# Altium project Q24_ECU_V1.PrjPcb (part 2 of 3)

## Sheet DebuggerConnectors.SchDoc
size A4
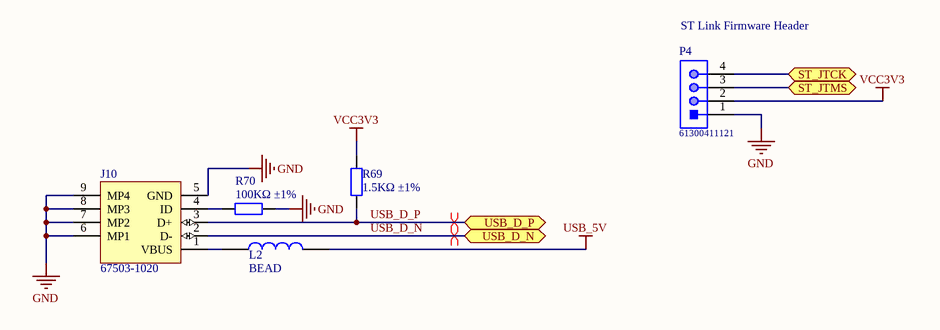
[diagram p7: DebuggerConnectors.SchDoc]

### Parts
J10  67503-1020  [MOLX-67503-1020_V]
L2  BEAD  [0603_L]
P4  61300411121  [61300411121]
R69  1.5KΩ ±1%  [0402_R]
R70  100KΩ ±1%  [0402_R]

### Ports
ST_JTCK (bidir), ST_JTMS (bidir), USB_D_N (bidir), USB_D_P (bidir)

### Nets
GND: J10.5(GND) J10.6(MP1) J10.7(MP2) J10.8(MP3) J10.9(MP4) P4.1 R70.2
USB_5V: L2.2
VCC3V3: P4.2 R69.2
ST_JTCK: P4.4 ; port ST_JTCK
ST_JTMS: P4.3 ; port ST_JTMS
USB_D_N: J10.2(D-) ; port USB_D_N
USB_D_P: J10.3(D+) R69.1 ; port USB_D_P
NetJ10_1: J10.1(VBUS) L2.1
NetJ10_4: J10.4(ID) R70.1

### Layout directives
differential pair: USB_D_N, USB_D_P

### Notes on the sheet
- (near P4) ST Link Firmware Header

### Library data of the parts
J10 = CMP-0411-00002-1: USB, MINI, SMD, RA KME04-USBMU03A01; Manufacturer: Molex; ComponentLink1URL: http://www.molex.com/; PartNumber: 67503-1020; Mounting Technology: Surface Mount; ComponentLink1Description: Manufacturer URL; Terminal Pitch: 0.8 mm; DatasheetVersion: Rev F, 06/2009; ComponentLink2Description: Datasheet; PackageDescription: Mini USB Connector, SMT, Righer Angle; ComponentLink2URL: http://www.molex.com/pdm_docs/sd/675031020_sd.pdf; PackageReference: 67503-1020
L2 = 0603 100R@100Mhz 1A: Ferrite Bead; Notepad: *; Package: 0603; Supplier: LC; SuppliersPartNumber: C64181
P4 = CMP-1502-01064-1: THT Vertical Pin Header WR-PHD, Pitch 2.54 mm, Single Row, 4 pins; Manufacturer: Wurth Elektronik; Withstanding Voltage: 500VAC; Rated Current: 3A; Working Voltage: 250VAC; Pin Number: 4; Gender: Male; Contact Resistance: 20mOhm; Pitch: 2.54mm; Manufacturer URL: http://www.we-online.de; Operating Temperature: -40to105degC; Packaging: Bag; Mounting Technology: THT; Package Reference: 61300411121; Datasheet URL: https://katalog.we-online.de/em/datasheet/6130xx11121.pdf; Publisher: WurthElektronik; Part Number: 61300411121; Row Number: Single; Orientation: Vertical
R69 = 0402 1.5K (1501) 1%: Chip resistor; Manufacturer: Uniroyal Elec; PartNumber: 0402WGF1501TCE; Power: 1/16W; ComponentLink1Description: Supplier link; ComponentLink1URL: http://www.szlcsc.com/product/details_26610.html; Package: 0402; Supplier: LC; SuppliersPartNumber: C25867; Resistance: 1.5KΩ; Tolerance: 1%
R70 = 0402 100K (1003) 1%: Chip resistor; Manufacturer: Uniroyal Elec; PartNumber: 0402WGF1003TCE; Power: 1/16W; ComponentLink1Description: Supplier link; ComponentLink1URL: http://www.szlcsc.com/product/details_26484.html; Package: 0402; Supplier: LC; SuppliersPartNumber: C25741; Resistance: 100KΩ; Tolerance: 1%

## Sheet 12V_POWER_BULKHEAD.SchDoc
size A4
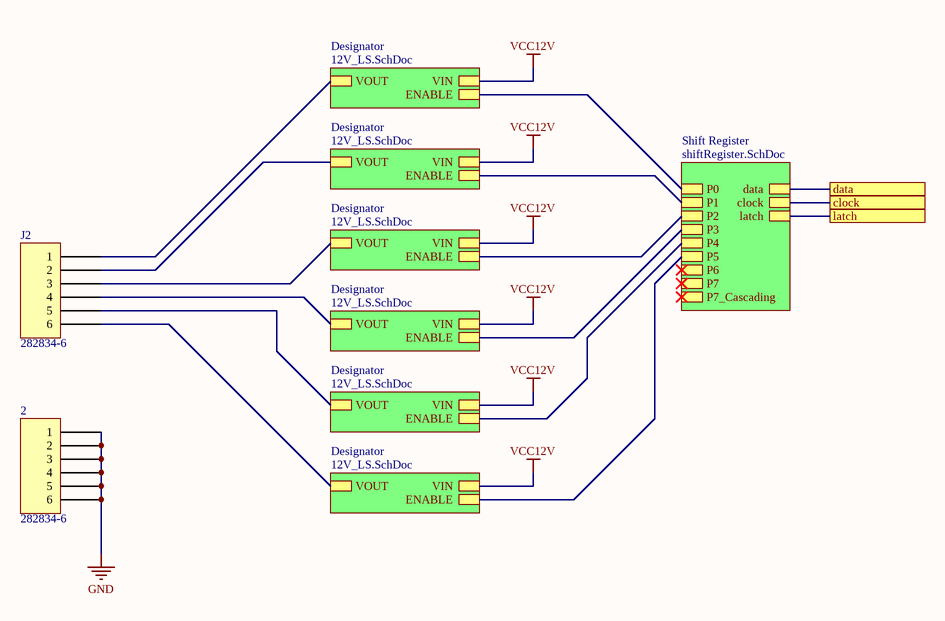
[diagram p8: 12V_POWER_BULKHEAD.SchDoc]

### Parts
2  282834-6  [TE 282834-6]
J2  282834-6  [TE 282834-6]

### Sub-sheets
Designator = 12V_LS.SchDoc: VOUT, ENABLE, VIN
Designator = 12V_LS.SchDoc: VOUT, ENABLE, VIN
Designator = 12V_LS.SchDoc: VOUT, ENABLE, VIN
Designator = 12V_LS.SchDoc: VOUT, ENABLE, VIN
Designator = 12V_LS.SchDoc: VOUT, ENABLE, VIN
Designator = 12V_LS.SchDoc: VOUT, ENABLE, VIN
Shift Register = shiftRegister.SchDoc: P0, P1, P2, P3, P4, P5, P6, P7, P7_Cascading, data, clock, latch

### Ports
clock, data, latch

### Nets
GND: 2.1 2.2 2.3 2.4 2.5 2.6
VCC12V: sheet Designator/VIN, sheet Designator/VIN, sheet Designator/VIN, sheet Designator/VIN, sheet Designator/VIN, sheet Designator/VIN
12V_CLOCK: port clock, sheet Shift Register/clock
12V_DATA: port data, sheet Shift Register/data
12V_LATCH: port latch, sheet Shift Register/latch
Net12_LOAD_SWITCH_12V_Power_And_Ground_Designator#1_2: sheet Shift Register/P0, sheet Designator/ENABLE
Net12_LOAD_SWITCH_12V_Power_And_Ground_Designator#1_7: J2.1 ; sheet Designator/VOUT
Net12_LOAD_SWITCH_12V_Power_And_Ground_Designator#2_2: sheet Shift Register/P1, sheet Designator/ENABLE
Net12_LOAD_SWITCH_12V_Power_And_Ground_Designator#2_7: J2.2 ; sheet Designator/VOUT
Net12_LOAD_SWITCH_12V_Power_And_Ground_Designator#3_2: sheet Shift Register/P2, sheet Designator/ENABLE
Net12_LOAD_SWITCH_12V_Power_And_Ground_Designator#3_7: J2.3 ; sheet Designator/VOUT
Net12_LOAD_SWITCH_12V_Power_And_Ground_Designator#4_2: sheet Shift Register/P3, sheet Designator/ENABLE
Net12_LOAD_SWITCH_12V_Power_And_Ground_Designator#4_7: J2.4 ; sheet Designator/VOUT
Net12_LOAD_SWITCH_12V_Power_And_Ground_Designator#5_2: sheet Shift Register/P4, sheet Designator/ENABLE
Net12_LOAD_SWITCH_12V_Power_And_Ground_Designator#5_7: J2.5 ; sheet Designator/VOUT
Net12_LOAD_SWITCH_12V_Power_And_Ground_Designator#6_2: sheet Shift Register/P5, sheet Designator/ENABLE
Net12_LOAD_SWITCH_12V_Power_And_Ground_Designator#6_7: J2.6 ; sheet Designator/VOUT

### Library data of the parts
2 J2 = 282834-6: TERM BLK 6P SIDE ENT 2.54MM PCB; Manufacturer: TE Connectivity AMP Connectors; Current: 10A; Mating Orientation: Horizontal with Board; Number of Levels: 1; Pitch: 0.100" (2.54mm); Positions Per Level: 6; Voltage: 150V; Wire Gauge: 16-30 AWG; Wire Termination: Screw - Rising Cage Clamp; Part Number: 282834-6; Color: Green; ComponentLink1Description: Datasheet; ComponentLink1URL: https://www.te.com/commerce/DocumentDelivery/DDEController?Action=srchrtrv&DocNm=282834&DocType=Customer+Drawing&DocLang=English; ComponentLink2Description: DigiKey Link; ComponentLink2URL: http://digikey.com/product-detail/en/te-connectivity-amp-connectors/282834-6/A98337-ND/1153267; LastUpdated: 2020-01-15 4:16:31 AM; Lifecycle Status: Active; Minimum Order: 1; Mounting Type: Through Hole; Packaging: Bulk; Part Status: Active; Price: 4.72; Series: Buchanan; Supplier 1: DigiKey; Supplier Part Number 1: A98337-ND

## Sheet shiftRegister.SchDoc
size A4
Used 2 times, as channels 12V Power And Ground/Shift Register, 5V Power And Ground/Shift Register. Parts and nets are listed once, with the designators drawn on the sheet.
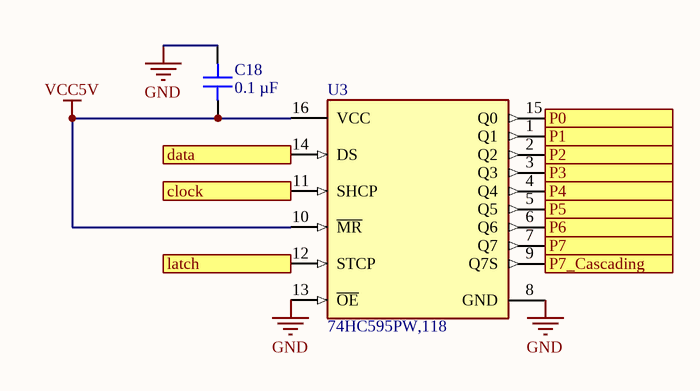
[diagram p9: shiftRegister.SchDoc]

### Parts
C18  0.1 µF  [CAP 0603_1608]
U3  74HC595PW,118  [FP-SOT403-1-MFG]

### Ports
clock, data, latch, P0, P1, P2, P3, P4, P5, P6, P7, P7_Cascading

### Nets
GND: C18.2 U3.8(GND) U3.13(~{OE})
VCC5V: C18.1 U3.10(~{MR}) U3.16(VCC)
clock: U3.11(SHCP) ; port clock
data: U3.14(DS) ; port data
latch: U3.12(STCP) ; port latch
P0: U3.15(Q0) ; port P0
P1: U3.1(Q1) ; port P1
P2: U3.2(Q2) ; port P2
P3: U3.3(Q3) ; port P3
P4: U3.4(Q4) ; port P4
P5: U3.5(Q5) ; port P5
P6: U3.6(Q6) ; port P6
P7: U3.7(Q7) ; port P7
P7_Cascading: U3.9(Q7S) ; port P7_Cascading

### Channels
12V Power And Ground/Shift Register: designators end in _Shift_Register2; ports clock=12V_CLOCK data=12V_DATA latch=12V_LATCH P0=Net12_LOAD_SWITCH_12V_Power_And_Ground_Designator#1_2 P1=Net12_LOAD_SWITCH_12V_Power_And_Ground_Designator#2_2 P2=Net12_LOAD_SWITCH_12V_Power_And_Ground_Designator#3_2 P3=Net12_LOAD_SWITCH_12V_Power_And_Ground_Designator#4_2 P4=Net12_LOAD_SWITCH_12V_Power_And_Ground_Designator#5_2 P5=Net12_LOAD_SWITCH_12V_Power_And_Ground_Designator#6_2 P6=NetU3_Shift_Register2_6 P7=NetU3_Shift_Register2_7 P7_Cascading=NetU3_Shift_Register2_9
5V Power And Ground/Shift Register: designators end in _Shift_Register1; ports clock=5V_CLOCK data=5V_DATA latch=5V_LATCH P0=NetIC1_5VLS1_3 P1=NetIC1_5VLS2_3 P2=NetIC1_5VLS3_3 P3=NetIC1_5VLS4_3 P4=NetIC1_5VLS5_3 P5=NetIC1_5VLS6_3 P6=NetU3_Shift_Register1_6 P7=NetU3_Shift_Register1_7 P7_Cascading=NetU3_Shift_Register1_9

### Library data of the parts
C18 = C0603C104K5RAC7411: CAP CER 0.1UF 50V X7R 0603; manufacturer: KEMET; Tolerance: ±10%; Part Number: C0603C104K5RAC7411; Value: 0.1 µF; Applications: Bypass, Decoupling; Capacitance: 0.1 µF; componentlink1description: Datasheet; componentlink1url: https://api.kemet.com/component-edge/download/datasheet/C0603C104K5RAC7411.pdf; componentlink2description: DigiKey Link; componentlink2url: https://www.digikey.com/en/products/detail/kemet/C0603C104K5RAC7411/3317013; Device Package: 0603 (1608 Metric); lastupdated: 2023-06-20 7:12:54 PM; Lifecycle Status: Active; Minimum Order: 1; Mounting Type: Surface Mount, MLCC; Operating Temperature: -55°C ~ 125°C; Package / Case: 0603 (1608 Metric); packaging: TapeAndReel; partid: 2233; Part Status: Active; price: 0.01; series: SMD Comm X7R; Size / Dimension: 0.063" L x 0.031" W (1.60mm x 0.80mm); Supplier 1: DigiKey; Supplier Part Number 1: 399-C0603C104K5RAC7411CT-ND; Temperature Coefficient: X7R; Thickness (Max): 0.035" (0.90mm); Voltage - Rated: 50V
U3 = CMP-14351-000004-1: IC SHIFT REGISTER 8BIT 16TSSOP

## Sheet 12V_LS.SchDoc
size A4
Used 9 times, as channels 12V Power And Ground/Designator, 12V Power And Ground/Designator, 12V Power And Ground/Designator, 12V Power And Ground/Designator, 12V Power And Ground/Designator, 12V Power And Ground/Designator, Motor Controller 1/Designator, Motor Controller 2/Designator, Steering/Designator. Parts and nets are listed once, with the designators drawn on the sheet.
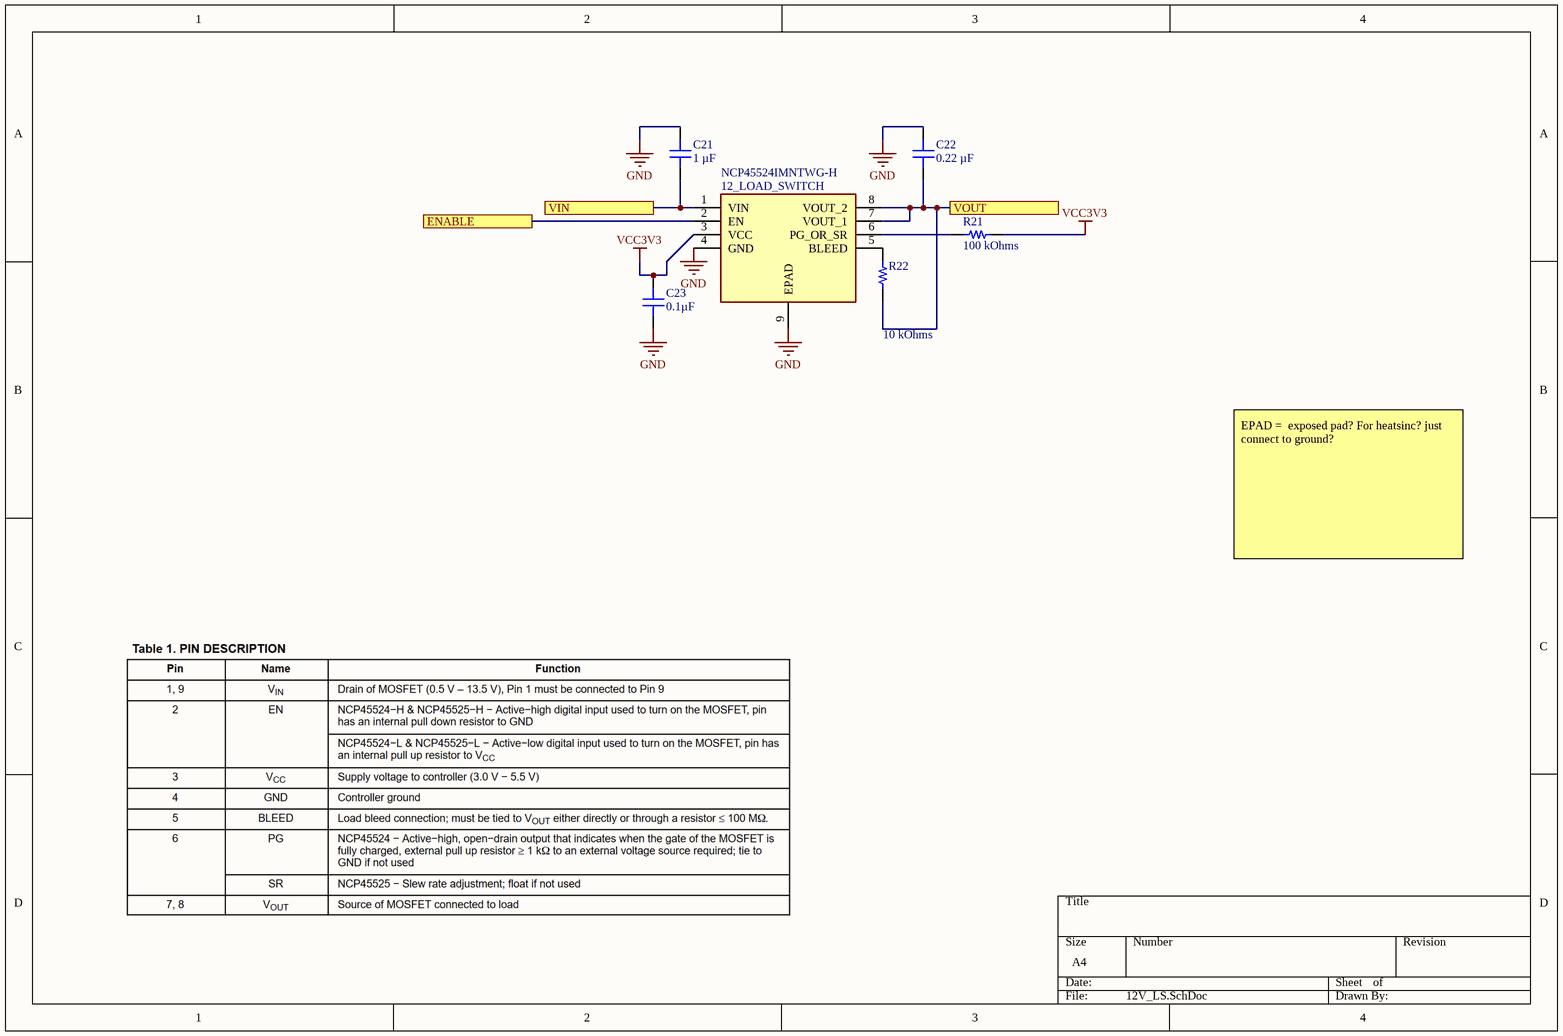
[diagram p10: 12V_LS.SchDoc]

### Parts
12_LOAD_SWITCH  NCP45524IMNTWG-H  [SON50P200X200X100-9N]
C21  1 µF  [CAP 0402_1005]
C22  0.22 µF  [CAP 0603_1608]
C23  0.1µF  [CAP 0402_1005]
R21  100 kOhms  [RES 0603_1608]
R22  10 kOhms  [RES 0603_1608]

### Ports
ENABLE, VIN, VOUT

### Nets
GND: 12_LOAD_SWITCH.4(GND) 12_LOAD_SWITCH.9(EPAD) C21.2 C22.2 C23.1
VCC3V3: 12_LOAD_SWITCH.3(VCC) C23.2 R21.2
ENABLE: 12_LOAD_SWITCH.2(EN) ; port ENABLE
VIN: 12_LOAD_SWITCH.1(VIN) C21.1 ; port VIN
VOUT: 12_LOAD_SWITCH.7(VOUT_1) 12_LOAD_SWITCH.8(VOUT_2) C22.1 R22.1 ; port VOUT
Net12_LOAD_SWITCH_5: 12_LOAD_SWITCH.5(BLEED) R22.2
Net12_LOAD_SWITCH_6: 12_LOAD_SWITCH.6(PG_OR_SR) R21.1

### Channels
12V Power And Ground/Designator: designators 12_LOAD_SWITCH=12_LOAD_SWITCH_12V_Power_And_Ground_Designator#1 C21=C21_12V_Power_And_Ground_Designator#1 C22=C22_Designator6 C23=C23_12V_Power_And_Ground_Designator#1 R21=R21_Designator6 R22=R22_Designator6; ports ENABLE=Net12_LOAD_SWITCH_12V_Power_And_Ground_Designator#1_2 VIN=VCC12V VOUT=Net12_LOAD_SWITCH_12V_Power_And_Ground_Designator#1_7
12V Power And Ground/Designator: designators 12_LOAD_SWITCH=12_LOAD_SWITCH_12V_Power_And_Ground_Designator#2 C21=C21_12V_Power_And_Ground_Designator#2 C22=C22_Designator5 C23=C23_12V_Power_And_Ground_Designator#2 R21=R21_Designator5 R22=R22_Designator5; ports ENABLE=Net12_LOAD_SWITCH_12V_Power_And_Ground_Designator#2_2 VIN=VCC12V VOUT=Net12_LOAD_SWITCH_12V_Power_And_Ground_Designator#2_7
12V Power And Ground/Designator: designators 12_LOAD_SWITCH=12_LOAD_SWITCH_12V_Power_And_Ground_Designator#3 C21=C21_12V_Power_And_Ground_Designator#3 C22=C22_Designator4 C23=C23_12V_Power_And_Ground_Designator#3 R21=R21_Designator4 R22=R22_Designator4; ports ENABLE=Net12_LOAD_SWITCH_12V_Power_And_Ground_Designator#3_2 VIN=VCC12V VOUT=Net12_LOAD_SWITCH_12V_Power_And_Ground_Designator#3_7
12V Power And Ground/Designator: designators 12_LOAD_SWITCH=12_LOAD_SWITCH_12V_Power_And_Ground_Designator#4 C21=C21_12V_Power_And_Ground_Designator#4 C22=C22_Designator3 C23=C23_12V_Power_And_Ground_Designator#4 R21=R21_Designator3 R22=R22_Designator3; ports ENABLE=Net12_LOAD_SWITCH_12V_Power_And_Ground_Designator#4_2 VIN=VCC12V VOUT=Net12_LOAD_SWITCH_12V_Power_And_Ground_Designator#4_7
12V Power And Ground/Designator: designators 12_LOAD_SWITCH=12_LOAD_SWITCH_12V_Power_And_Ground_Designator#5 C21=C21_12V_Power_And_Ground_Designator#5 C22=C22_Designator2 C23=C23_12V_Power_And_Ground_Designator#5 R21=R21_Designator2 R22=R22_Designator2; ports ENABLE=Net12_LOAD_SWITCH_12V_Power_And_Ground_Designator#5_2 VIN=VCC12V VOUT=Net12_LOAD_SWITCH_12V_Power_And_Ground_Designator#5_7
12V Power And Ground/Designator: designators 12_LOAD_SWITCH=12_LOAD_SWITCH_12V_Power_And_Ground_Designator#6 C21=C21_12V_Power_And_Ground_Designator#6 C22=C22_Designator1 C23=C23_12V_Power_And_Ground_Designator#6 R21=R21_Designator1 R22=R22_Designator1; ports ENABLE=Net12_LOAD_SWITCH_12V_Power_And_Ground_Designator#6_2 VIN=VCC12V VOUT=Net12_LOAD_SWITCH_12V_Power_And_Ground_Designator#6_7
Motor Controller 1/Designator: designators 12_LOAD_SWITCH=12_LOAD_SWITCH_Motor_Controller_1_Designator C21=C21_Motor_Controller_1_Designator C22=C22_Designator7 C23=C23_Motor_Controller_1_Designator R21=R21_Designator7 R22=R22_Designator7; ports ENABLE=MC1_ENABLE VIN=VCC12V VOUT=Net12_LOAD_SWITCH_Motor_Controller_1_Designator_7
Motor Controller 2/Designator: designators 12_LOAD_SWITCH=12_LOAD_SWITCH_Motor_Controller_2_Designator C21=C21_Motor_Controller_2_Designator C22=C22_Designator8 C23=C23_Motor_Controller_2_Designator R21=R21_Designator8 R22=R22_Designator8; ports ENABLE=MC2_ENABLE VIN=VCC12V VOUT=Net12_LOAD_SWITCH_Motor_Controller_2_Designator_7
Steering/Designator: designators 12_LOAD_SWITCH=12_LOAD_SWITCH_Steering_Designator C21=C21_Steering_Designator C22=C22_Designator9 C23=C23_Steering_Designator R21=R21_Designator9 R22=R22_Designator9; ports ENABLE=STEERING_ENABLE VIN=VCC12V VOUT=Net12_LOAD_SWITCH_Steering_Designator_7

### Notes on the sheet
- EPAD =  exposed pad? For heatsinc? just connect to ground?

### Library data of the parts
12_LOAD_SWITCH = NCP45524IMNTWG-H: Integrated Circuit; Manufacturer_Name: onsemi; Datasheet Link: http://www.onsemi.com/pub/Collateral/NCP45524-D.PDF; Height: 1mm; Manufacturer_Part_Number: NCP45524IMNTWG-H; Mouser Part Number: 863-NCP45524IMNTWG-H; Mouser Price/Stock: https://www.mouser.co.uk/ProductDetail/onsemi/NCP45524IMNTWG-H?qs=xGcJQ%252BnsJwsBahshTeqn2Q%3D%3D; Arrow Part Number: NCP45524IMNTWG-H; Arrow Price/Stock: https://www.arrow.com/en/products/ncp45524imntwg-h/on-semiconductor
C21 = GRM155C71A105KE11D: CAP CER 1UF 10V X7S 0402; manufacturer: Murata Electronics; Tolerance: ±10%; Part Number: GRM155C71A105KE11D; Value: 1 µF; Applications: General Purpose; Capacitance: 1 µF; componentlink1description: Datasheet; componentlink1url: https://search.murata.co.jp/Ceramy/image/img/A01X/G101/ENG/GRM155C71A105KE11-01.pdf; componentlink2description: DigiKey Link; componentlink2url: https://www.digikey.com/en/products/detail/murata-electronics/GRM155C71A105KE11D/6606086; Device Package: 0402 (1005 Metric); lastupdated: 2023-06-04 7:05:15 PM; Lifecycle Status: Active; Minimum Order: 1; Mounting Type: Surface Mount, MLCC; Operating Temperature: -55°C ~ 125°C; Package / Case: 0402 (1005 Metric); packaging: TapeAndReel; partid: 1749; Part Status: Active; price: 0.01; series: GRM; Size / Dimension: 0.039" L x 0.020" W (1.00mm x 0.50mm); Supplier 1: DigiKey; Supplier Part Number 1: 490-14457-1-ND; Temperature Coefficient: X7S; Thickness (Max): 0.024" (0.60mm); Voltage - Rated: 10V
C22 = CC0603KRX7R8BB224: CAP CER 0.22UF 25V X7R 0603; manufacturer: Yageo; Tolerance: ±10%; Part Number: CC0603KRX7R8BB224; Value: 0.22 µF; Applications: General Purpose; Capacitance: 0.22 µF; componentlink1description: Datasheet; componentlink1url: https://www.yageo.com/upload/media/product/productsearch/datasheet/mlcc/UPY-GPHC_X7R_6.3V-to-50V_18.pdf; componentlink2description: DigiKey Link; componentlink2url: https://www.digikey.com/en/products/detail/yageo/CC0603KRX7R8BB224/5195211; Device Package: 0603 (1608 Metric); lastupdated: 2023-06-21 7:13:30 PM; Lifecycle Status: Active; Minimum Order: 1; Mounting Type: Surface Mount, MLCC; Operating Temperature: -55°C ~ 125°C; Package / Case: 0603 (1608 Metric); packaging: TapeAndReel; partid: 2214; Part Status: Active; price: 0.01; series: CC; Size / Dimension: 0.063" L x 0.031" W (1.60mm x 0.80mm); Supplier 1: DigiKey; Supplier Part Number 1: 311-1803-1-ND; Temperature Coefficient: X7R; Thickness (Max): 0.035" (0.90mm); Voltage - Rated: 25V
C23 = 0402ZC104KAT2A: CAP CER 0.1UF 10V X7R 0402; manufacturer: AVX Corporation; Tolerance: ±10%; Part Number: 0402ZC104KAT2A; Value: 0.1µF; Applications: General Purpose; Capacitance: 0.1µF; componentlink1description: Datasheet; componentlink1url: http://datasheets.avx.com/X7RDielectric.pdf; componentlink2description: DigiKey Link; componentlink2url: http://digikey.com/product-detail/en/avx-corporation/0402ZC104KAT2A/478-7891-1-ND/3881514; Device Package: 0402 (1005 Metric); lastupdated: 2022-02-08 12:26:59 PM; Lifecycle Status: Active; Minimum Order: 1; Mounting Type: Surface Mount, MLCC; Operating Temperature: -55°C ~ 125°C; Package / Case: 0402 (1005 Metric); packaging: TapeAndReel; partid: 1757; Part Status: Active; price: 0.09; series: -; Size / Dimension: 0.039" L x 0.020" W (1.00mm x 0.50mm); Supplier 1: DigiKey; Supplier Part Number 1: 478-7891-1-ND; Temperature Coefficient: X7R; Thickness (Max): 0.022" (0.55mm); Voltage - Rated: 10V
R21 = RNCS0603BKE100K: RES 100K OHM 0.1% 1/16W 0603; Manufacturer: Stackpole Electronics Inc; Power (Watts): 0.063W, 1/16W; Temperature Coefficient: ±25ppm/°C; Part Number: RNCS0603BKE100K; Value: 100 kOhms; ComponentLink1Description: Datasheet; ComponentLink1URL: https://www.seielect.com/catalog/sei-rncs_rnch.pdf; ComponentLink2Description: DigiKey Link; ComponentLink2URL: https://www.digikey.com/en/products/detail/stackpole-electronics-inc/RNCS0603BKE100K/1708835; Composition: Thin Film; Device Package: 0603 (1608 Metric); Features: Anti-Corrosive, Automotive AEC-Q200, Moisture Resistant; Height - Seated (Max): 0.022" (0.55mm); LastUpdated: 2023-06-04 7:36:27 PM; Lifecycle Status: Active; Minimum Order: 1; Number of Terminations: 2; Operating Temperature: -55°C ~ 155°C; Package / Case: 0603 (1608 Metric); Packaging: TapeAndReel; PartId: 4849; Part Status: Active; Price: 0.07; Ratings: AEC-Q200; Resistance: 100 kOhms; Series: RNCS; Size / Dimension: 0.061" L x 0.031" W (1.55mm x 0.80mm); Supplier 1: DigiKey; Supplier Part Number 1: RNCS0603BKE100KCT-ND; Supplier Device Package: 0603; Tolerance: ±0.1%
R22 = RNCS0603BKE10K0: RES 10K OHM 0.1% 1/16W 0603; Manufacturer: Stackpole Electronics Inc; Power (Watts): 0.063W, 1/16W; Temperature Coefficient: ±25ppm/°C; Part Number: RNCS0603BKE10K0; Value: 10 kOhms; ComponentLink1Description: Datasheet; ComponentLink1URL: https://www.seielect.com/catalog/sei-rncs_rnch.pdf; ComponentLink2Description: DigiKey Link; ComponentLink2URL: https://www.digikey.com/en/products/detail/stackpole-electronics-inc/RNCS0603BKE10K0/1708836; Composition: Thin Film; Device Package: 0603 (1608 Metric); Features: Anti-Corrosive, Automotive AEC-Q200, Moisture Resistant; Height - Seated (Max): 0.022" (0.55mm); LastUpdated: 2023-06-04 7:36:27 PM; Lifecycle Status: Active; Minimum Order: 1; Number of Terminations: 2; Operating Temperature: -55°C ~ 155°C; Package / Case: 0603 (1608 Metric); Packaging: TapeAndReel; PartId: 4838; Part Status: Active; Price: 0.07; Ratings: AEC-Q200; Resistance: 10 kOhms; Series: RNCS; Size / Dimension: 0.061" L x 0.031" W (1.55mm x 0.80mm); Supplier 1: DigiKey; Supplier Part Number 1: RNCS0603BKE10K0CT-ND; Supplier Device Package: 0603; Tolerance: ±0.1%

## Sheet boardPower.SchDoc
size A4
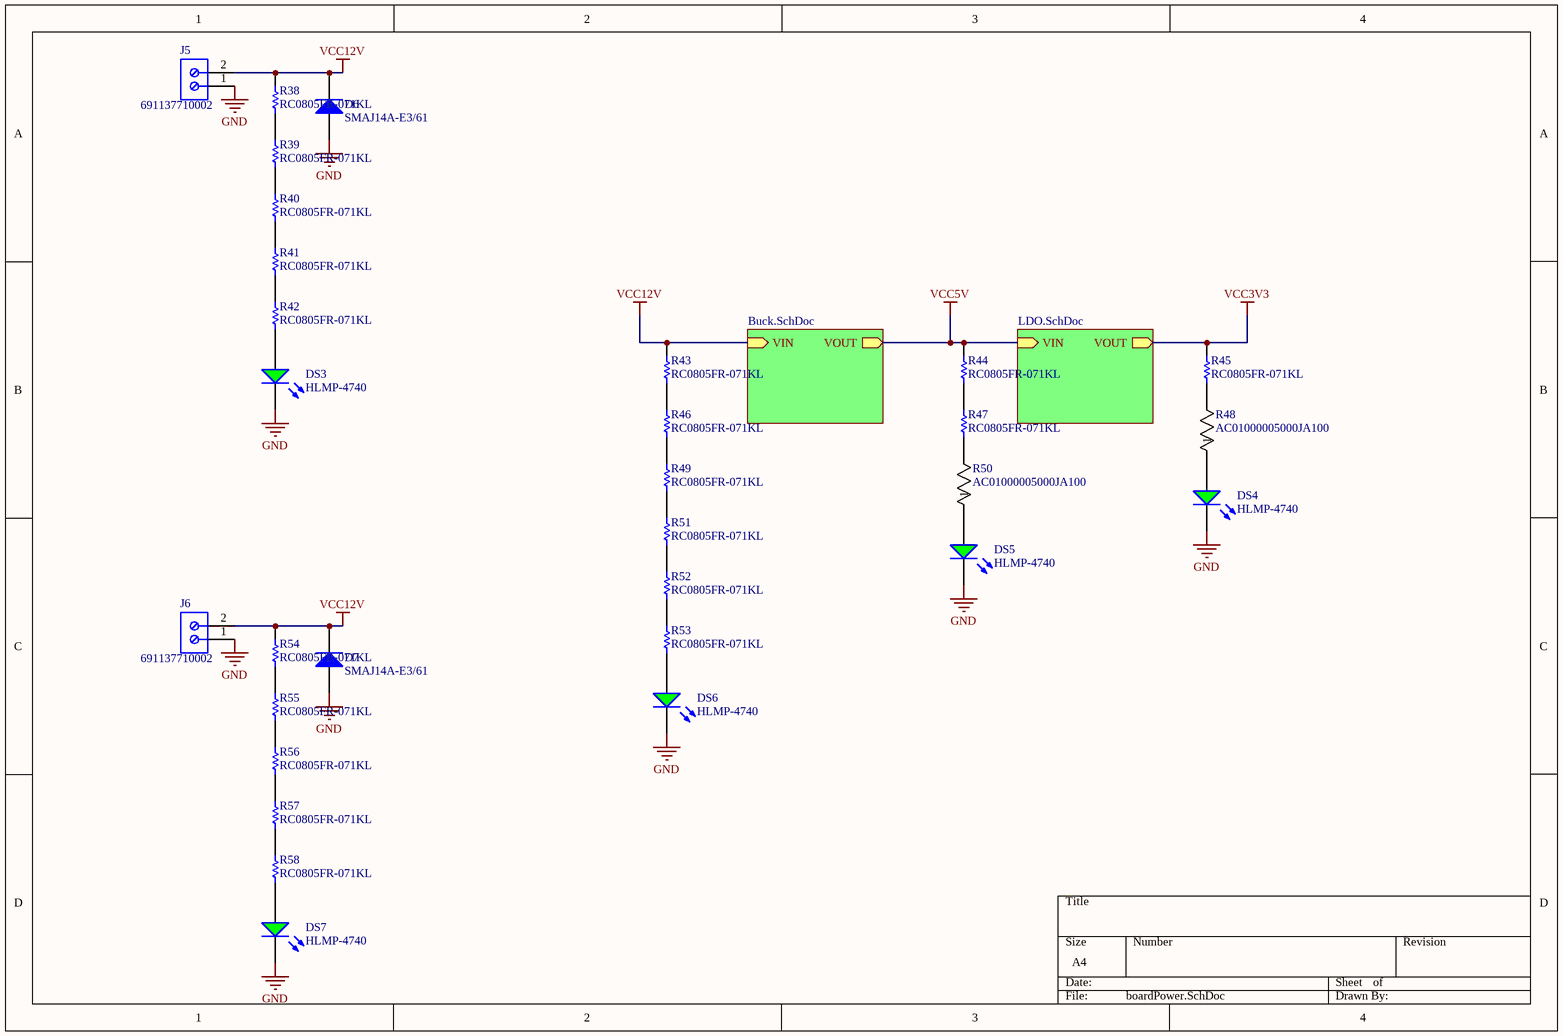
[diagram p11: boardPower.SchDoc]

### Parts
D6  SMAJ14A-E3/61  [VISH-DO-214AC-2_L]
D7  SMAJ14A-E3/61  [VISH-DO-214AC-2_L]
DS3  HLMP-4740  [AVAG-HLMP-4740]
DS4  HLMP-4740  [AVAG-HLMP-4740]
DS5  HLMP-4740  [AVAG-HLMP-4740]
DS6  HLMP-4740  [AVAG-HLMP-4740]
DS7  HLMP-4740  [AVAG-HLMP-4740]
J5  691137710002  [691137710002]
J6  691137710002  [691137710002]
R38  RC0805FR-071KL  [RESC2013X60X35ML10T20]
R39  RC0805FR-071KL  [RESC2013X60X35ML10T20]
R40  RC0805FR-071KL  [RESC2013X60X35ML10T20]
R41  RC0805FR-071KL  [RESC2013X60X35ML10T20]
R42  RC0805FR-071KL  [RESC2013X60X35ML10T20]
R43  RC0805FR-071KL  [RESC2013X60X35ML10T20]
R44  RC0805FR-071KL  [RESC2013X60X35ML10T20]
R45  RC0805FR-071KL  [RESC2013X60X35ML10T20]
R46  RC0805FR-071KL  [RESC2013X60X35ML10T20]
R47  RC0805FR-071KL  [RESC2013X60X35ML10T20]
R48  AC01000005000JA100  [RES_AC01_VIS]
R49  RC0805FR-071KL  [RESC2013X60X35ML10T20]
R50  AC01000005000JA100  [RES_AC01_VIS]
R51  RC0805FR-071KL  [RESC2013X60X35ML10T20]
R52  RC0805FR-071KL  [RESC2013X60X35ML10T20]
R53  RC0805FR-071KL  [RESC2013X60X35ML10T20]
R54  RC0805FR-071KL  [RESC2013X60X35ML10T20]
R55  RC0805FR-071KL  [RESC2013X60X35ML10T20]
R56  RC0805FR-071KL  [RESC2013X60X35ML10T20]
R57  RC0805FR-071KL  [RESC2013X60X35ML10T20]
R58  RC0805FR-071KL  [RESC2013X60X35ML10T20]

### Sub-sheets
Buck = Buck.SchDoc: VIN (in), VOUT (out)
LDO = LDO.SchDoc: VIN (in), VOUT (out)

### Nets
GND: D6.2(A) D7.2(A) DS3.2(K) DS4.2(K) DS5.2(K) DS6.2(K) DS7.2(K) J5.1 J6.1
VCC3V3: R45.2 ; sheet LDO/VOUT
VCC5V: R44.2 ; sheet Buck/VOUT, sheet LDO/VIN
VCC12V: D6.1(K) D7.1(K) J5.2 J6.2 R38.2 R43.2 R54.2 ; sheet Buck/VIN
NetDS3_1: DS3.1(A) R42.1
NetDS4_1: DS4.1(A) R48.1
NetDS5_1: DS5.1(A) R50.1
NetDS6_1: DS6.1(A) R53.1
NetDS7_1: DS7.1(A) R58.1
NetR38_1: R38.1 R39.2
NetR39_1: R39.1 R40.2
NetR40_1: R40.1 R41.2
NetR41_1: R41.1 R42.2
NetR43_1: R43.1 R46.2
NetR44_1: R44.1 R47.2
NetR45_1: R45.1 R48.2
NetR46_1: R46.1 R49.2
NetR47_1: R47.1 R50.2
NetR49_1: R49.1 R51.2
NetR51_1: R51.1 R52.2
NetR52_1: R52.1 R53.2
NetR54_1: R54.1 R55.2
NetR55_1: R55.1 R56.2
NetR56_1: R56.1 R57.2
NetR57_1: R57.1 R58.2

### Library data of the parts
D6 D7 = CMP-0548-00224-2: Transient Voltage Suppressor, 6.40 to 231 V, 14 V Stand-off Voltage, Uni-Directional, -55 to 155 degC, 2-pin DO-214AC, Pb-Free, Tape and Reel; Manufacturer: Vishay Semiconductor; PPPM (W): 400, 300; VWM (V): 14; VBR Uni-Directional (V): 6.4 to 231; IFSM: 40 A; ID (uA): 1; PackageDescription: 2-Pin DO-214AC (SMA), Body 4.245 x 2.665 mm; ComponentLink2URL: http://www.vishay.com/docs/88390/smaj50a.pdf; Mounting Technology: Surface Mount; PartNumber: SMAJ14A-E3/61; Operating Junction and Storage Temperature Range: -55 to 150 degC; ComponentLink2Description: Datasheet; Packing: Tape and Reel; PackageReference: DO-214AC-2; ComponentLink3Description: Package Specification; ComponentLink1URL: http://www.vishay.com/; RoHS: TRUE; ComponentLink3URL: http://www.vishay.com/docs/88390/smaj50a.pdf; ComponentLink1Description: Manufacturer URL; DatasheetVersion: 12/8/2013
DS3-DS7 = CMP-2000-06413-1: T-1 3/4 (5 mm) Low Current LED Lamp, Green, 1.9 V, -20 to 100 degC, 2-Pin THD, RoHS, Bulk; Manufacturer: AvagoTechnologies; Type: Uni-Color; Peak Wavelength: 565nm; Rad Hard: No; Viewing Angle: 50°; Dominant Wavelength/Color Temperature: 569nm; Number of LEDs: 1; Lens Appearance: ColoredDiffused; Lens Shape Type: Circular; Mounting Orientation: TopMount; Intensity: 2.3mcd; Datasheet Version: 07/2014; Category: LEDs; Datasheet URL: http://docs.avagotech.com/docs/AV02-1557EN; Packaging: Bulk; Pin Count: 2; Mounting Technology: ThroughHole; Package Reference: HLMP-4740; Mounting: ThroughHole; Manufacturer URL: http://www.avagotech.com/; Color: Green; Package: 2T-13/4; Package Description: 2-Pin Through Hole Device, Dia 5.845 mm, Pitch 2.54 mm
J5 J6 = CMP-1502-03324-2: NexarPartId: 78871135; Voltage Rating: 300V; Number of Contacts: 2; Current Rating: 16A; Lead Pitch: 5mm; Height: 11.6mm; Packaging: Box; RoHS: Non-Compliant; Contact Material: Nickel, Tin; Max Operating Temperature: 120°C; Number of Pins: 2; Min Operating Temperature: -30°C; Number of Rows: 1
R38-R47 R49 R51-R58 = CMP-2100-03671-1: Chip Resistor, 1 KOhm, +/- 1%, 125 mW, -55 to 155 degC, 0805 (2012 Metric), RoHS, Tape and Reel; Manufacturer: Yageo; Temperature Coefficient: 100ppm/degreesC; Voltage Rating (DC): 150V; Max Power Dissipation: 125mW; Resistance: 1KOhm; Number of Pins: 2; Number of Terminations: 2; Datasheet URL: http://www.yageo.com/NewPortal/yageodocoutput?fileName=/pdf/R-Chip/PYu-RC_Group_51_RoHS_L_5.pdf; Length: 0.079inch; Package Description: 2-Pin Surface Mounted Device, Body 2 x 1.25 mm; Depth: 1.25mm; Height: 0.024inch; Military Standard: Not; Case/Package: 0805; Package Reference: 0805; RoHSCompliant: true; Lead Free: LeadFree; Packaging: TapeandReel; Package Quantity: 1; Datasheet Version: Rev. 5, 10/2016; Tolerance: 1%; Min Operating Temperature: -55degC; Voltage Rating: 150V; Composition: ThickFilm; Case Code (Imperial): 0805; Power Rating: 125mW; Width: 0.049inch; Case Code (Metric): 2012; Manufacturer URL: http://www.yageo.com/; Max Operating Temperature: 155degC; REACH SVHC: Unknown; Termination: SMD/SMT
R48 R50 = CMP-00030-39746512-1: AC01000005000JA100 Res Wirewound 500 Ohm 5% 1W 100ppm/°C to 180ppm/°C Conformal AXL Thru-Hole Ammo Pack; Voltage Rating (DC): 22V; Lead Diameter: 800µm; Resistance: 500Ω; Weight: 519.986953mg; Number of Pins: 2; Min Operating Temperature: -40°C; Case/Package: Axial; Schedule B: 8533210080, 8533210080; Features: Flame Retardant Coating; Power Rating: 1W; Max Power Dissipation: 1W; Packaging: Tape & Box (TB); RoHS: Compliant; REACH SVHC: Unknown; NexarPartId: 39746512; Temperature Coefficient: 180ppm/°C; Diameter: 4.3mm; Contact Plating: Tin; Radiation Hardening: No; Max Operating Temperature: 275°C; Length: 11mm; Tolerance: 5%; Composition: Wirewound; Number of Terminations: 2; Termination: Axial; Voltage Rating: 22V

## Sheet Buck.SchDoc
size A4
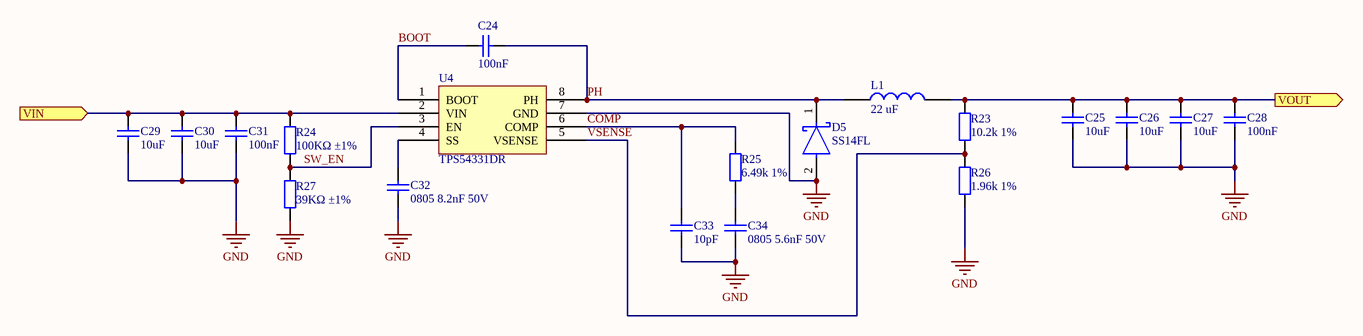
[diagram p12: Buck.SchDoc]

### Parts
C24  100nF  [0603_C]
C25  10uF  [0603_C]
C26  10uF  [0603_C]
C27  10uF  [0603_C]
C28  100nF  [0603_C]
C29  10uF  [0805_C]
C30  10uF  [0805_C]
C31  100nF  [0603_C]
C32  0805 8.2nF 50V  [0805_C]
C33  10pF  [0603_C]
C34  0805 5.6nF 50V  [0805_C]
D5  SS14FL  [FP-425AD-MFG]
L1  22 uF  [COBU-DR74-4R7-R_V]
R23  10.2k 1%  [1206_R]
R24  100KΩ ±1%  [0805_R]
R25  6.49k 1%  [0805_R]
R26  1.96k 1%  [1206_R]
R27  39KΩ ±1%  [0805_R]
U4  TPS54331DR  [SOIC-8_150mil]

### Ports
VIN (in), VOUT (out)

### Nets
GND: C25.1 C26.1 C27.1 C28.1 C29.1 C30.1 C31.1 C32.1 C33.1 C34.1 D5.2(A) R26.1 R27.1 U4.7(GND)
VCC5V: C25.2 C26.2 C27.2 C28.2 L1.2 R23.1 ; port VOUT
VCC12V: C29.2 C30.2 C31.2 R24.1 U4.2(VIN) ; port VIN
BOOT: C24.2 U4.1(BOOT)
COMP: C33.2 R25.2 U4.6(COMP)
PH: C24.1 D5.1(C) L1.1 U4.8(PH)
SW_EN: R24.2 R27.2 U4.3(EN)
VSENSE: R23.2 R26.2 U4.5(VSENSE)
NetC32_2: C32.2 U4.4(SS)
NetC34_2: C34.2 R25.1

### Library data of the parts
C24 C28 C31 = 0603 100nF (104) 10% 50V: Chip capacitors; Manufacturer: YAGEO; PartNumber: CC0603KRX7R9BB104; Tolerance: 10%; Voltage: 50V; ComponentLink1Description: Supplier link; ComponentLink1URL: http://www.szlcsc.com/product/details_15331.html; Package: 0603; Supplier: LC; SuppliersPartNumber: C14663; Capacitance: 100nF
C25-C27 = 0603 10uF (106) 10% 10V: Chip capacitors; Manufacturer: Samsung Electro-Mechanics; PartNumber: CL10A106KP8NNNC; Tolerance: 10%; Voltage: 10V; ComponentLink1Description: Supplier link; ComponentLink1URL: http://www.szlcsc.com/product/details_20411.html; Package: 0603; Supplier: LC; SuppliersPartNumber: C19702; Capacitance: 10uF
C29 C30 = 0805 10uF (106) 10% 25V: Chip capacitors; Manufacturer: Samsung Electro-Mechanics; PartNumber: CL21A106KAYNNNE; Tolerance: 10%; Voltage: 25V; ComponentLink1Description: Supplier link; ComponentLink1URL: http://www.szlcsc.com/product/details_16532.html; Package: 0805; Supplier: LC; SuppliersPartNumber: C15850; Capacitance: 10uF
C32 = 0805 8.2nF 50V: PartNumber: CL21B822KBANNNC; LCSC: C170117
C33 = 0603 10pF (100) 5% 50V: Chip capacitors; Manufacturer: Samsung Electro-Mechanics; PartNumber: CL10C100JB8NNNC; Tolerance: 5%; Voltage: 50V; ComponentLink1Description: Supplier link; ComponentLink1URL: http://www.szlcsc.com/product/details_1986.html; Package: 0603; Supplier: LC; SuppliersPartNumber: C1634; Capacitance: 10pF
C34 = 0805 5.6nF 50V: PartNumber: CL21B562KBANNNC; LCSC: C153719
D5 = CMP-07162-000013-1: DIODE SCHOTTKY 40V 1A SOD123F; Manufacturer: ON Semiconductor; Max Junction Temp: +125°C; Value: 60pF; Max Surge Forward Current: 40A; Peak Reverse Current: 30uA; Device Class L3: Schottky Diodes; Reverse Voltage: 40V; Automotive: No; Temperature: -55°C to +125°C; Mouser Description: SS14FL Series 40 V 1 A Surface Mount Schottky Barrier Rectifier - SOD-123F; Octopart: https://octopart.com/ss14fl-on+semiconductor-84331601; Height: 1.08mm; Temperature Range Low: -55°C; Category: Diode; Lead Free: Yes; Device Class L1: Discrete Semiconductors; Digikey Description: DIODE SCHOTTKY 40V 1A SOD123F; RoHS: TRUE; ComponentLink2Description: Datasheet; Manufacturer Part Number: SS14FL; Forward Current: 1A; Capacitance: 60pF; Package: 425AD; Device Class L2: Diodes; Temperature Range High: +125°C; Max Repetitive Reverse Voltage: 40V; ComponentLink2URL: https://www.onsemi.com/pub/Collateral/SS14FL-D.PDF
L1 = SRP6540-5R6M
R23 = 1206 10.2k 1%: PartNumber: 1206W4F1022T5E; LCSC: C247410
R24 = 0805 100K (1003) 1%: Chip resistor; Manufacturer: Uniroyal Elec; Power: 1/8W; ComponentLink1Description: Supplier link; ComponentLink1URL: http://www.szlcsc.com/product/details_18095.html; Package: 0805; Supplier: LC; SuppliersPartNumber: C17407; Tolerance: 1%
R25 = 0805 6.49k 1%: PartNumber: 0805W8F6491T5E; LCSC: C17769
R26 = 1206 1.96k 1%: PartNumber: 1206W4F1022T5E; LCSC: C247410
R27 = 0805 39K (3902) 1%: Chip resistor; Manufacturer: Uniroyal Elec; Power: 1/8W; ComponentLink1Description: Supplier link; ComponentLink1URL: http://www.szlcsc.com/product/details_26569.html; Package: 0805; Supplier: LC; SuppliersPartNumber: C25826; Tolerance: 1%
U4 = TPS54331DR_[C9865]: DC-DC芯片; ComponentLink1Description: 供应商链接; ComponentLink1URL: http://www.szlcsc.com/product/details_10397.html; Package: SOIC-8_150mil; Supplier: LC; SuppliersPartNumber: C9865

## Sheet LDO.SchDoc
size A4
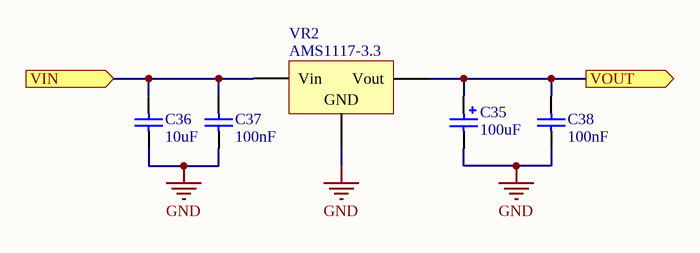
[diagram p13: LDO.SchDoc]

### Parts
C35  100uF  [CASE-B_3528]
C36  10uF  [1206_C]
C37  100nF  [0805_C]
C38  100nF  [1206_C]
VR2  AMS1117-3.3  [SOT-223]

### Ports
VIN (in), VOUT (out)

### Nets
GND: C35.2 C36.1 C37.1 C38.1 VR2.1(GND)
VCC3V3: C35.1 C38.2 VR2.2(Vout) ; port VOUT
VCC5V: C36.2 C37.2 VR2.3(Vin) ; port VIN

### Library data of the parts
C35 = 3528 100uF (107) 10% 6.3V: Tantalum capacitor; Manufacturer: AVX; PartNumber: TAJB107K006RNJ; Tolerance: 10%; Voltage: 6.3V; ComponentLink1Description: Supplier link; ComponentLink1URL: http://www.szlcsc.com/product/details_16815.html; Package: 3528; Supplier: LC; SuppliersPartNumber: C16133; Capacitance: 100uF
C36 = 1206 10uF (106) 10% 50V: Chip capacitors; Manufacturer: Samsung Electro-Mechanics; PartNumber: CL31A106KBHNNNE; Tolerance: 10%; Voltage: 50V; ComponentLink1Description: Supplier link; ComponentLink1URL: http://www.szlcsc.com/product/details_14236.html; Package: 1206; Supplier: LC; SuppliersPartNumber: C13585; Capacitance: 10uF
C37 = 0805 100nF(104) 10% 50V: Chip capacitors; Manufacturer: YAGEO; PartNumber: CC0805KRX7R9BB104; Tolerance: 10%; Voltage: 50V; ComponentLink1Description: Supplier link; ComponentLink1URL: http://www.szlcsc.com/product/details_50686.html; Package: 0805; Supplier: LC; SuppliersPartNumber: C49678; Capacitance: 100nF
C38 = 1206 100nF (104) 10% 50V: Chip capacitors; Manufacturer: Samsung Electro-Mechanics; PartNumber: CL31B104KBCNNNC; Tolerance: 10%; Voltage: 50V; ComponentLink1Description: Supplier link; ComponentLink1URL: http://www.szlcsc.com/product/details_25237.html; Package: 1206; Supplier: LC; SuppliersPartNumber: C24497; Capacitance: 100nF
VR2 = SOT-223 AMS1117-3.3: 低压差线性稳压(LDO); ComponentLink1Description: 供应商链接; ComponentLink1URL: http://www.szlcsc.com/product/details_6652.html; Package: SOT-223; Supplier: LC; SuppliersPartNumber: C6186

## Sheet Connectors.SchDoc
size A4
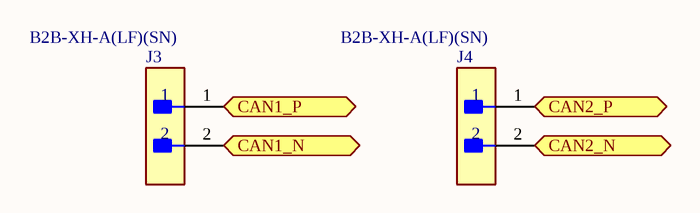
[diagram p14: Connectors.SchDoc]

### Parts
J3  B2B-XH-A(LF)(SN)  [FP-B2B-XH-A_LF_SN-MFG]
J4  B2B-XH-A(LF)(SN)  [FP-B2B-XH-A_LF_SN-MFG]

### Ports
CAN1_N (bidir), CAN1_P (bidir), CAN2_N (bidir), CAN2_P (bidir)

### Nets
CAN1_N: J3.1 J3.2 J4.1 J4.2 ; port CAN1_P, port CAN1_N, port CAN2_P, port CAN2_N

### Library data of the parts
J3 J4 = CMP-2000-05888-3: CONN HEADER VERT 2POS 2.5MM; Current Rating: 3A; Voltage Rating: 250V; Number of Contacts: 2; Contact Resistance: 20mR; Wire/Cable Gauge: 22AWG; Insulation Resistance: 1GR; Connector Type: Male Pin; Packaging: Bulk; Contact Material: Brass; Lead Free: Lead Free; Orientation: Straight; Contact Plating: Tin; Max Current Rating: 3A; Termination: Solder; Fastening Type: Detent; Depth: 5.75mm; Housing Material: Polyamide; REACH SVHC: No SVHC; Series: XH; Voltage Rating (AC): 250V; Number of Positions: 2; Color: Natural; Contact Type: Male Pin; Max Voltage Rating (DC): 250V; Pitch: 2.5mm; Lead Pitch: 2.5mm; Mount: Through Hole; Max Operating Temperature: 85°C; Length: 7.4mm; Max Voltage Rating (AC): 250V; Min Operating Temperature: -25°C; Number of Rows: 1; Housing Color: White

## Sheet 12V_SIGNAL_BULKHEAD.SchDoc
size A4
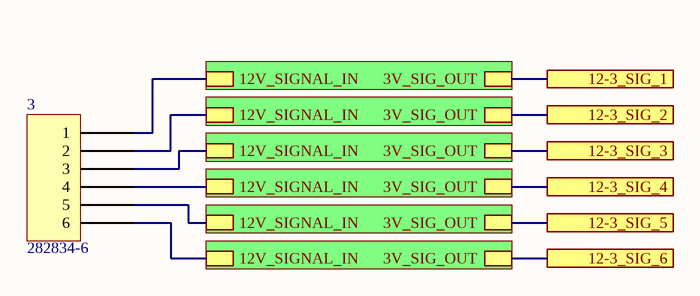
[diagram p15: 12V_SIGNAL_BULKHEAD.SchDoc]

### Parts
3  282834-6  [TE 282834-6]

### Sub-sheets
? = 12_TO_3V3_VOLTAGE_DIVIDER.SchDoc: 12V_SIGNAL_IN, 3V_SIG_OUT
? = 12_TO_3V3_VOLTAGE_DIVIDER.SchDoc: 12V_SIGNAL_IN, 3V_SIG_OUT
? = 12_TO_3V3_VOLTAGE_DIVIDER.SchDoc: 12V_SIGNAL_IN, 3V_SIG_OUT
? = 12_TO_3V3_VOLTAGE_DIVIDER.SchDoc: 12V_SIGNAL_IN, 3V_SIG_OUT
? = 12_TO_3V3_VOLTAGE_DIVIDER.SchDoc: 12V_SIGNAL_IN, 3V_SIG_OUT
? = 12_TO_3V3_VOLTAGE_DIVIDER.SchDoc: 12V_SIGNAL_IN, 3V_SIG_OUT

### Ports
12-3_SIG_1, 12-3_SIG_2, 12-3_SIG_3, 12-3_SIG_4, 12-3_SIG_5, 12-3_SIG_6

### Nets
12-3_1: port 12-3_SIG_1, sheet /3V_SIG_OUT
12-3_2: port 12-3_SIG_2, sheet /3V_SIG_OUT
12-3_3: port 12-3_SIG_3, sheet /3V_SIG_OUT
12-3_4: port 12-3_SIG_4, sheet /3V_SIG_OUT
12-3_5: port 12-3_SIG_5, sheet /3V_SIG_OUT
12-3_6: port 12-3_SIG_6, sheet /3V_SIG_OUT
Net3_1: 3.1 ; sheet /12V_SIGNAL_IN
Net3_2: 3.2 ; sheet /12V_SIGNAL_IN
Net3_3: 3.3 ; sheet /12V_SIGNAL_IN
Net3_4: 3.4 ; sheet /12V_SIGNAL_IN
Net3_5: 3.5 ; sheet /12V_SIGNAL_IN
Net3_6: 3.6 ; sheet /12V_SIGNAL_IN

### Library data of the parts
3 = 282834-6: as 2 on sheet 12V_POWER_BULKHEAD; Part Number: 282834-6; Color: Green; ComponentLink1Description: Datasheet; ComponentLink1URL: https://www.te.com/commerce/DocumentDelivery/DDEController?Action=srchrtrv&DocNm=282834&DocType=Customer+Drawing&DocLang=English; ComponentLink2Description: DigiKey Link; ComponentLink2URL: http://digikey.com/product-detail/en/te-connectivity-amp-connectors/282834-6/A98337-ND/1153267; LastUpdated: 2020-01-15 4:16:31 AM; Lifecycle Status: Active; Minimum Order: 1; Mounting Type: Through Hole; Packaging: Bulk; Part Status: Active; Price: 4.72; Series: Buchanan; Supplier 1: DigiKey; Supplier Part Number 1: A98337-ND

## Sheet 12_TO_3V3_VOLTAGE_DIVIDER.SchDoc
size A4
Used 6 times, as channels 12 Volt Signal Bulkhead/, 12 Volt Signal Bulkhead/, 12 Volt Signal Bulkhead/, 12 Volt Signal Bulkhead/, 12 Volt Signal Bulkhead/, 12 Volt Signal Bulkhead/. Parts and nets are listed once, with the designators drawn on the sheet.
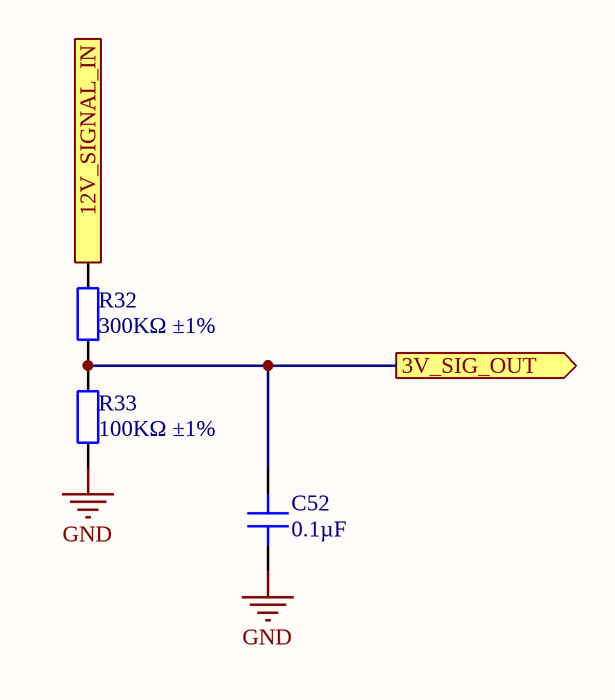
[diagram p16: 12_TO_3V3_VOLTAGE_DIVIDER.SchDoc]

### Parts
C52  0.1µF  [CAP 0402_1005]
R32  300KΩ ±1%  [0402_R]
R33  100KΩ ±1%  [0402_R]

### Ports
3V_SIG_OUT (out), 12V_SIGNAL_IN

### Nets
GND: C52.1 R33.1
3V_SIG_OUT: C52.2 R32.1 R33.2 ; port 3V_SIG_OUT
12V_SIGNAL_IN: R32.2 ; port 12V_SIGNAL_IN

### Channels
12 Volt Signal Bulkhead/: designators end in _12_Volt_Signal_Bulkhead_#1; ports 3V_SIG_OUT=12-3_1 12V_SIGNAL_IN=Net3_1
12 Volt Signal Bulkhead/: designators end in _12_Volt_Signal_Bulkhead_#2; ports 3V_SIG_OUT=12-3_2 12V_SIGNAL_IN=Net3_2
12 Volt Signal Bulkhead/: designators end in _12_Volt_Signal_Bulkhead_#3; ports 3V_SIG_OUT=12-3_3 12V_SIGNAL_IN=Net3_3
12 Volt Signal Bulkhead/: designators end in _12_Volt_Signal_Bulkhead_#4; ports 3V_SIG_OUT=12-3_4 12V_SIGNAL_IN=Net3_4
12 Volt Signal Bulkhead/: designators end in _12_Volt_Signal_Bulkhead_#5; ports 3V_SIG_OUT=12-3_5 12V_SIGNAL_IN=Net3_5
12 Volt Signal Bulkhead/: designators end in _12_Volt_Signal_Bulkhead_#6; ports 3V_SIG_OUT=12-3_6 12V_SIGNAL_IN=Net3_6

### Library data of the parts
C52 = C0402C104K4RECAUTO: CAP CER 0402 0.1UF 16V X7R 10%; Manufacturer: KEMET; Part Number: C0402C104K4RECAUTO; Value: 0.1µF; Applications: Automotive, ESD Protection; Capacitance: 0.1µF; ComponentLink1Description: Datasheet; ComponentLink1URL: https://api.kemet.com/component-edge/download/datasheet/C0402C104K4RECAUTO.pdf; ComponentLink2Description: DigiKey Link; ComponentLink2URL: http://digikey.com/product-detail/en/kemet/C0402C104K4RECAUTO/399-17167-1-ND/8563708; Device Package: 0402 (1005 Metric); LastUpdated: 2020-09-02 1:02:25 AM; Lifecycle Status: Active; Minimum Order: 1; Mounting Type: Surface Mount, MLCC; Operating Temperature: -55°C ~ 125°C; Package / Case: 0402 (1005 Metric); Packaging: TapeAndReel; PartId: 1731; Part Status: Active; Price: 0.02; Series: ESD SMD Auto X7R; Size / Dimension: 0.039" L x 0.020" W (1.00mm x 0.50mm); Supplier 1: DigiKey; Supplier Part Number 1: 399-17167-1-ND; Temperature Coefficient: X7R; Thickness (Max): 0.022" (0.55mm); Tolerance: ±10%; Voltage - Rated: 16V; Ratings: AEC-Q200
R32 = 0402 300K (3003) 1%: Chip resistor; Manufacturer: Uniroyal Elec; PartNumber: 0402WGF3003TCE; Power: 1/16W; ComponentLink1Description: Supplier link; ComponentLink1URL: http://www.szlcsc.com/product/details_26517.html; Package: 0402; Supplier: LC; SuppliersPartNumber: C25774; Resistance: 300KΩ; Tolerance: 1%
R33 = 0402 100K (1003) 1%: as R70 on sheet DebuggerConnectors; ComponentLink1Description: Supplier link; ComponentLink1URL: http://www.szlcsc.com/product/details_26484.html; Package: 0402; Supplier: LC; SuppliersPartNumber: C25741; Resistance: 100KΩ; Tolerance: 1%

## Sheet 5VBulkhead.SchDoc
size A4
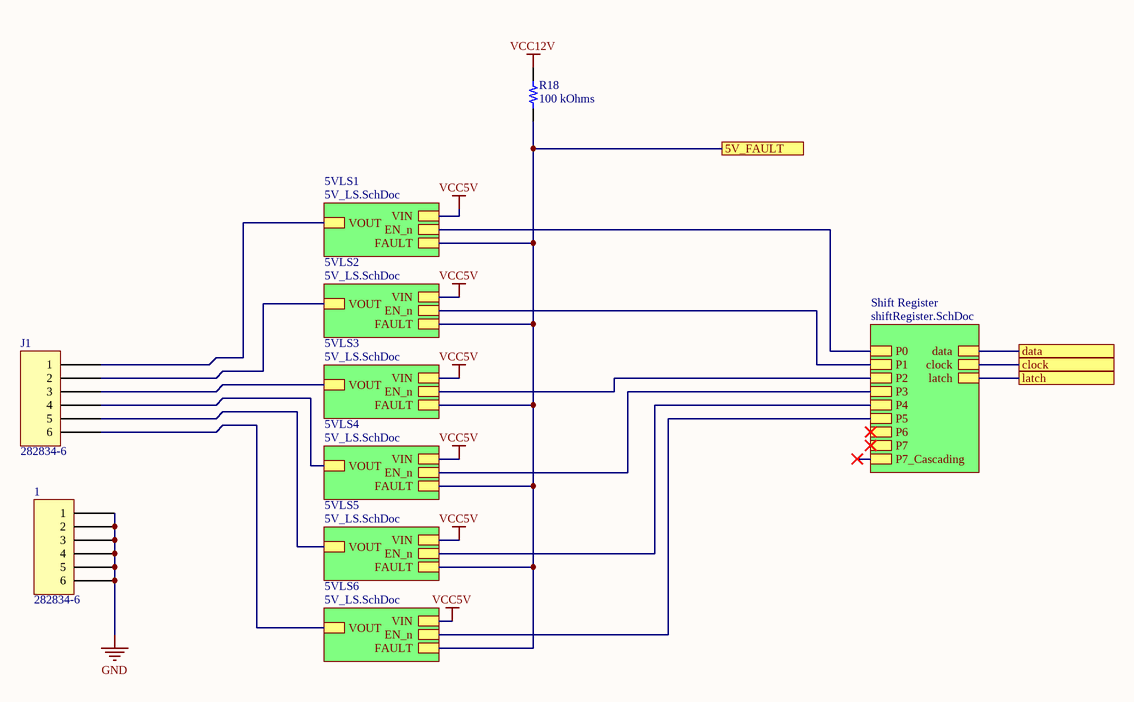
[diagram p17: 5VBulkhead.SchDoc]

### Parts
1  282834-6  [TE 282834-6]
J1  282834-6  [TE 282834-6]
R18  100 kOhms  [RES 0603_1608]

### Sub-sheets
5VLS1 = 5V_LS.SchDoc: VIN, VOUT, EN_n, FAULT
5VLS2 = 5V_LS.SchDoc: VIN, VOUT, EN_n, FAULT
5VLS3 = 5V_LS.SchDoc: VIN, VOUT, EN_n, FAULT
5VLS4 = 5V_LS.SchDoc: VIN, VOUT, EN_n, FAULT
5VLS5 = 5V_LS.SchDoc: VIN, VOUT, EN_n, FAULT
5VLS6 = 5V_LS.SchDoc: VIN, VOUT, EN_n, FAULT
Shift Register = shiftRegister.SchDoc: P0, P1, P2, P3, P4, P5, P6, P7, P7_Cascading, data, clock, latch

### Ports
5V_FAULT, clock, data, latch

### Nets
GND: 1.1 1.2 1.3 1.4 1.5 1.6
VCC5V: sheet 5VLS1/VIN, sheet 5VLS2/VIN, sheet 5VLS3/VIN, sheet 5VLS4/VIN, sheet 5VLS5/VIN, sheet 5VLS6/VIN
VCC12V: R18.2
5V_CLOCK: port clock, sheet Shift Register/clock
5V_DATA: port data, sheet Shift Register/data
5V_FAULT: R18.1 ; port 5V_FAULT, sheet 5VLS1/FAULT, sheet 5VLS2/FAULT, sheet 5VLS3/FAULT, sheet 5VLS4/FAULT, sheet 5VLS5/FAULT, sheet 5VLS6/FAULT
5V_LATCH: port latch, sheet Shift Register/latch
NetC20_5VLS1_2: J1.1 ; sheet 5VLS1/VOUT
NetC20_5VLS2_2: J1.2 ; sheet 5VLS2/VOUT
NetC20_5VLS3_2: J1.3 ; sheet 5VLS3/VOUT
NetC20_5VLS4_2: J1.4 ; sheet 5VLS4/VOUT
NetC20_5VLS5_2: J1.5 ; sheet 5VLS5/VOUT
NetC20_5VLS6_2: J1.6 ; sheet 5VLS6/VOUT
NetIC1_5VLS1_3: sheet Shift Register/P0, sheet 5VLS1/EN_n
NetIC1_5VLS2_3: sheet Shift Register/P1, sheet 5VLS2/EN_n
NetIC1_5VLS3_3: sheet Shift Register/P2, sheet 5VLS3/EN_n
NetIC1_5VLS4_3: sheet Shift Register/P3, sheet 5VLS4/EN_n
NetIC1_5VLS5_3: sheet Shift Register/P4, sheet 5VLS5/EN_n
NetIC1_5VLS6_3: sheet Shift Register/P5, sheet 5VLS6/EN_n

### Library data of the parts
1 J1 = 282834-6: as 2 on sheet 12V_POWER_BULKHEAD; Part Number: 282834-6; Color: Green; ComponentLink1Description: Datasheet; ComponentLink1URL: https://www.te.com/commerce/DocumentDelivery/DDEController?Action=srchrtrv&DocNm=282834&DocType=Customer+Drawing&DocLang=English; ComponentLink2Description: DigiKey Link; ComponentLink2URL: http://digikey.com/product-detail/en/te-connectivity-amp-connectors/282834-6/A98337-ND/1153267; LastUpdated: 2020-01-15 4:16:31 AM; Lifecycle Status: Active; Minimum Order: 1; Mounting Type: Through Hole; Packaging: Bulk; Part Status: Active; Price: 4.72; Series: Buchanan; Supplier 1: DigiKey; Supplier Part Number 1: A98337-ND
R18 = RNCS0603BKE100K: as R21 on sheet 12V_LS; Part Number: RNCS0603BKE100K; Value: 100 kOhms; ComponentLink1Description: Datasheet; ComponentLink1URL: https://www.seielect.com/catalog/sei-rncs_rnch.pdf; ComponentLink2Description: DigiKey Link; ComponentLink2URL: https://www.digikey.com/en/products/detail/stackpole-electronics-inc/RNCS0603BKE100K/1708835; Composition: Thin Film; Device Package: 0603 (1608 Metric); Features: Anti-Corrosive, Automotive AEC-Q200, Moisture Resistant; Height - Seated (Max): 0.022" (0.55mm); LastUpdated: 2023-06-08 7:45:17 PM; Lifecycle Status: Active; Minimum Order: 1; Number of Terminations: 2; Operating Temperature: -55°C ~ 155°C; Package / Case: 0603 (1608 Metric); Packaging: TapeAndReel; PartId: 4849; Part Status: Active; Price: 0.07; Ratings: AEC-Q200; Resistance: 100 kOhms; Series: RNCS; Size / Dimension: 0.061" L x 0.031" W (1.55mm x 0.80mm); Supplier 1: DigiKey; Supplier Part Number 1: RNCS0603BKE100KCT-ND; Supplier Device Package: 0603; Tolerance: ±0.1%

## Sheet 5V_LS.SchDoc
size A4
Used 6 times, as channels 5V Power And Ground/5VLS1, 5V Power And Ground/5VLS2, 5V Power And Ground/5VLS3, 5V Power And Ground/5VLS4, 5V Power And Ground/5VLS5, 5V Power And Ground/5VLS6. Parts and nets are listed once, with the designators drawn on the sheet.
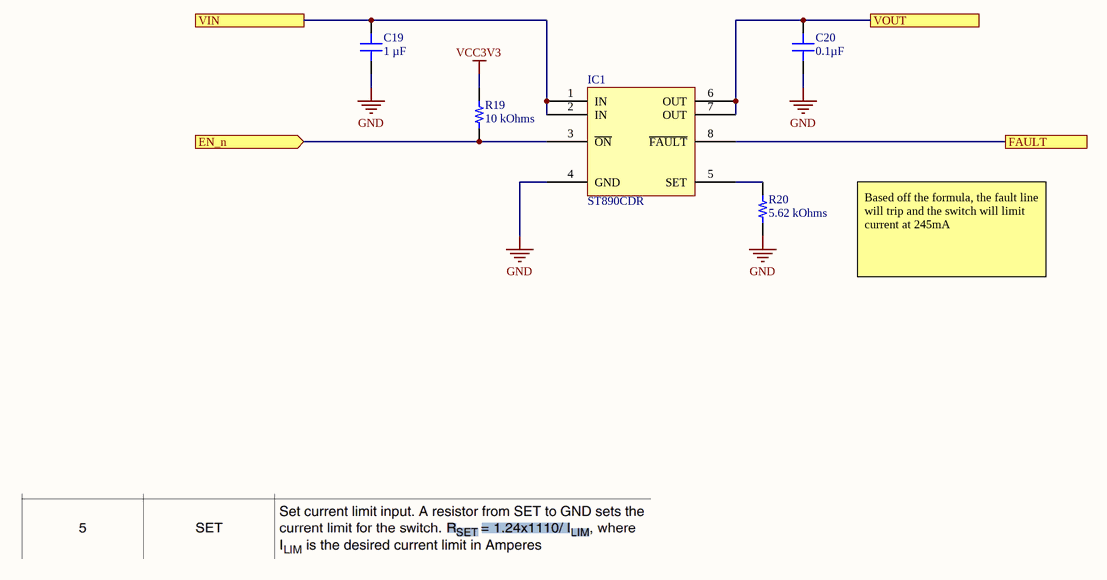
[diagram p18: 5V_LS.SchDoc]

### Parts
C19  1 µF  [CAP 0402_1005]
C20  0.1µF  [CAP 0402_1005]
IC1  ST890CDR  [ST SOIC-8N]
R19  10 kOhms  [RES 0402_1005]
R20  5.62 kOhms  [RES 0402_1005]

### Ports
EN_n (in), FAULT, VIN, VOUT

### Nets
GND: C19.1 C20.1 IC1.4(GND) R20.1
VCC3V3: R19.2
EN_n: IC1.3(~{ON}) R19.1 ; port EN_n
FAULT: IC1.8(~{FAULT}) ; port FAULT
VIN: C19.2 IC1.1(IN) IC1.2(IN) ; port VIN
VOUT: C20.2 IC1.6(OUT) IC1.7(OUT) ; port VOUT
NetIC1_5: IC1.5(SET) R20.2

### Channels
5V Power And Ground/5VLS1: designators end in _5VLS1; ports EN_n=NetIC1_5VLS1_3 FAULT=5V_FAULT VIN=VCC5V VOUT=NetC20_5VLS1_2
5V Power And Ground/5VLS2: designators end in _5VLS2; ports EN_n=NetIC1_5VLS2_3 FAULT=5V_FAULT VIN=VCC5V VOUT=NetC20_5VLS2_2
5V Power And Ground/5VLS3: designators end in _5VLS3; ports EN_n=NetIC1_5VLS3_3 FAULT=5V_FAULT VIN=VCC5V VOUT=NetC20_5VLS3_2
5V Power And Ground/5VLS4: designators end in _5VLS4; ports EN_n=NetIC1_5VLS4_3 FAULT=5V_FAULT VIN=VCC5V VOUT=NetC20_5VLS4_2
5V Power And Ground/5VLS5: designators end in _5VLS5; ports EN_n=NetIC1_5VLS5_3 FAULT=5V_FAULT VIN=VCC5V VOUT=NetC20_5VLS5_2
5V Power And Ground/5VLS6: designators end in _5VLS6; ports EN_n=NetIC1_5VLS6_3 FAULT=5V_FAULT VIN=VCC5V VOUT=NetC20_5VLS6_2

### Notes on the sheet
- Based off the formula, the fault line will trip and the switch will limit current at 245mA

### Library data of the parts
C19 = GRM155C71A105KE11D: as C21 on sheet 12V_LS; Part Number: GRM155C71A105KE11D; Value: 1 µF; Applications: General Purpose; Capacitance: 1 µF; componentlink1description: Datasheet; componentlink1url: https://search.murata.co.jp/Ceramy/image/img/A01X/G101/ENG/GRM155C71A105KE11-01.pdf; componentlink2description: DigiKey Link; componentlink2url: https://www.digikey.com/en/products/detail/murata-electronics/GRM155C71A105KE11D/6606086; Device Package: 0402 (1005 Metric); lastupdated: 2023-06-04 7:05:15 PM; Lifecycle Status: Active; Minimum Order: 1; Mounting Type: Surface Mount, MLCC; Operating Temperature: -55°C ~ 125°C; Package / Case: 0402 (1005 Metric); packaging: TapeAndReel; partid: 1749; Part Status: Active; price: 0.01; series: GRM; Size / Dimension: 0.039" L x 0.020" W (1.00mm x 0.50mm); Supplier 1: DigiKey; Supplier Part Number 1: 490-14457-1-ND; Temperature Coefficient: X7S; Thickness (Max): 0.024" (0.60mm); Voltage - Rated: 10V
C20 = 0402ZC104KAT2A: as C23 on sheet 12V_LS; Part Number: 0402ZC104KAT2A; Value: 0.1µF; Applications: General Purpose; Capacitance: 0.1µF; componentlink1description: Datasheet; componentlink1url: http://datasheets.avx.com/X7RDielectric.pdf; componentlink2description: DigiKey Link; componentlink2url: http://digikey.com/product-detail/en/avx-corporation/0402ZC104KAT2A/478-7891-1-ND/3881514; Device Package: 0402 (1005 Metric); lastupdated: 2022-02-08 12:26:59 PM; Lifecycle Status: Active; Minimum Order: 1; Mounting Type: Surface Mount, MLCC; Operating Temperature: -55°C ~ 125°C; Package / Case: 0402 (1005 Metric); packaging: TapeAndReel; partid: 1757; Part Status: Active; price: 0.09; series: -; Size / Dimension: 0.039" L x 0.020" W (1.00mm x 0.50mm); Supplier 1: DigiKey; Supplier Part Number 1: 478-7891-1-ND; Temperature Coefficient: X7R; Thickness (Max): 0.022" (0.55mm); Voltage - Rated: 10V
IC1 = ST890CDR: IC PWR SWITCH P-CHANNEL 1:1 8SO; Manufacturer: STMicroelectronics; Current - Output (Max): 1.2A; Fault Protection: Current Limiting (Adjustable), Over Temperature; Input Type: Non-Inverting; Interface: On/Off; Number of Outputs: 1; Output Configuration: High Side; Rds On (Typ): 75mOhm; Switch Type: General Purpose; Voltage - Load: 2.7V ~ 5.5V; Voltage - Supply (Vcc/Vdd): Not Required; Part Number: ST890CDR; ComponentLink1Description: Datasheet; ComponentLink1URL: http://www.st.com/content/ccc/resource/technical/document/datasheet/1a/8c/51/d8/96/28/4d/63/CD00002878.pdf/files/CD00002878.pdf/jcr:content/translations/en.CD00002878.pdf; ComponentLink2Description: DigiKey Link; ComponentLink2URL: http://digikey.com/product-detail/en/stmicroelectronics/ST890CDR/497-6543-1-ND/1865325; Device Package: 8-SOIC (0.154", 3.90mm Width); LastUpdated: 2020-05-24 9:33:45 PM; Lifecycle Status: Active; Minimum Order: 1; Mounting Type: Surface Mount; Operating Temperature: -40°C ~ 85°C (TA); Output Type: P-Channel; Package / Case: 8-SOIC (0.154", 3.90mm Width); Packaging: TapeAndReel; Part Status: Active; Price: 0.47; Ratio - Input:Output: 1:1; Series: -; Supplier 1: DigiKey; Supplier Part Number 1: 497-6543-1-ND; Supplier Device Package: 8-SO
R19 = RP73PF1E10KBTD: RES 10K OHM 0.1% 1/10W 0402; Manufacturer: TE Connectivity Passive Product; Power (Watts): 0.1W, 1/10W; Temperature Coefficient: ±25ppm/°C; Part Number: RP73PF1E10KBTD; Value: 10 kOhms; ComponentLink1Description: Datasheet; ComponentLink1URL: https://www.te.com/commerce/DocumentDelivery/DDEController?Action=srchrtrv&DocNm=1773272&DocType=DS&DocLang=English; ComponentLink2Description: DigiKey Link; ComponentLink2URL: https://www.digikey.com/en/products/detail/te-connectivity-passive-product/RP73PF1E10KBTD/8260957; Composition: Thin Film; Device Package: 0402 (1005 Metric); Height - Seated (Max): 0.014" (0.35mm); LastUpdated: 2023-06-04 7:27:27 PM; Lifecycle Status: Active; Minimum Order: 1; Number of Terminations: 2; Operating Temperature: -55°C ~ 155°C; Package / Case: 0402 (1005 Metric); Packaging: TapeAndReel; PartId: 2434; Part Status: Active; Price: 0.08; Resistance: 10 kOhms; Series: RP73, Holsworthy; Size / Dimension: 0.039" L x 0.020" W (1.00mm x 0.50mm); Supplier 1: DigiKey; Supplier Part Number 1: A127415CT-ND; Supplier Device Package: 0402; Tolerance: ±0.1%
R20 = RP73PF1E5K62BTD: RES 5.62K OHM 0.1% 1/10W 0402; Manufacturer: TE Connectivity Passive Product; Power (Watts): 0.1W, 1/10W; Temperature Coefficient: ±25ppm/°C; Part Number: RP73PF1E5K62BTD; Value: 5.62 kOhms; ComponentLink1Description: Datasheet; ComponentLink1URL: https://www.te.com/commerce/DocumentDelivery/DDEController?Action=srchrtrv&DocNm=1773272&DocType=DS&DocLang=English; ComponentLink2Description: DigiKey Link; ComponentLink2URL: https://www.digikey.com/en/products/detail/te-connectivity-passive-product/RP73PF1E5K62BTD/8260933; Composition: Thin Film; Device Package: 0402 (1005 Metric); Height - Seated (Max): 0.014" (0.35mm); LastUpdated: 2023-06-04 7:27:27 PM; Lifecycle Status: Active; Minimum Order: 1; Number of Terminations: 2; Operating Temperature: -55°C ~ 155°C; Package / Case: 0402 (1005 Metric); Packaging: TapeAndReel; PartId: 2425; Part Status: Active; Price: 0.08; Resistance: 5.62 kOhms; Series: RP73, Holsworthy; Size / Dimension: 0.039" L x 0.020" W (1.00mm x 0.50mm); Supplier 1: DigiKey; Supplier Part Number 1: A127391CT-ND; Supplier Device Package: 0402; Tolerance: ±0.1%

## Sheet 5V_SIGNAL_BULKHEAD.SchDoc
size A4
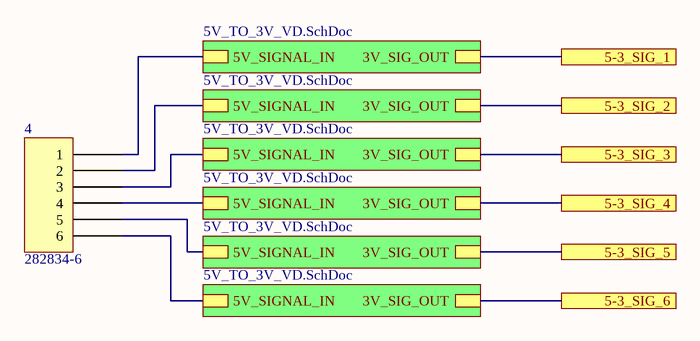
[diagram p19: 5V_SIGNAL_BULKHEAD.SchDoc]

### Parts
4  282834-6  [TE 282834-6]

### Sub-sheets
Designator = 5V_TO_3V_VD.SchDoc: 5V_SIGNAL_IN, 3V_SIG_OUT
Designator = 5V_TO_3V_VD.SchDoc: 5V_SIGNAL_IN, 3V_SIG_OUT
Designator = 5V_TO_3V_VD.SchDoc: 5V_SIGNAL_IN, 3V_SIG_OUT
Designator = 5V_TO_3V_VD.SchDoc: 5V_SIGNAL_IN, 3V_SIG_OUT
Designator = 5V_TO_3V_VD.SchDoc: 5V_SIGNAL_IN, 3V_SIG_OUT
Designator = 5V_TO_3V_VD.SchDoc: 5V_SIGNAL_IN, 3V_SIG_OUT

### Ports
5-3_SIG_1, 5-3_SIG_2, 5-3_SIG_3, 5-3_SIG_4, 5-3_SIG_5, 5-3_SIG_6

### Nets
5-3_1: port 5-3_SIG_1, sheet Designator/3V_SIG_OUT
5-3_2: port 5-3_SIG_2, sheet Designator/3V_SIG_OUT
5-3_3: port 5-3_SIG_3, sheet Designator/3V_SIG_OUT
5-3_4: port 5-3_SIG_4, sheet Designator/3V_SIG_OUT
5-3_5: port 5-3_SIG_5, sheet Designator/3V_SIG_OUT
5-3_6: port 5-3_SIG_6, sheet Designator/3V_SIG_OUT
Net4_1: 4.1 ; sheet Designator/5V_SIGNAL_IN
Net4_2: 4.2 ; sheet Designator/5V_SIGNAL_IN
Net4_3: 4.3 ; sheet Designator/5V_SIGNAL_IN
Net4_4: 4.4 ; sheet Designator/5V_SIGNAL_IN
Net4_5: 4.5 ; sheet Designator/5V_SIGNAL_IN
Net4_6: 4.6 ; sheet Designator/5V_SIGNAL_IN

### Library data of the parts
4 = 282834-6: as 2 on sheet 12V_POWER_BULKHEAD; Part Number: 282834-6; Color: Green; ComponentLink1Description: Datasheet; ComponentLink1URL: https://www.te.com/commerce/DocumentDelivery/DDEController?Action=srchrtrv&DocNm=282834&DocType=Customer+Drawing&DocLang=English; ComponentLink2Description: DigiKey Link; ComponentLink2URL: http://digikey.com/product-detail/en/te-connectivity-amp-connectors/282834-6/A98337-ND/1153267; LastUpdated: 2020-01-15 4:16:31 AM; Lifecycle Status: Active; Minimum Order: 1; Mounting Type: Through Hole; Packaging: Bulk; Part Status: Active; Price: 4.72; Series: Buchanan; Supplier 1: DigiKey; Supplier Part Number 1: A98337-ND